# Altium schematic sheet AudioAmpSchematic.SchDoc
size A4
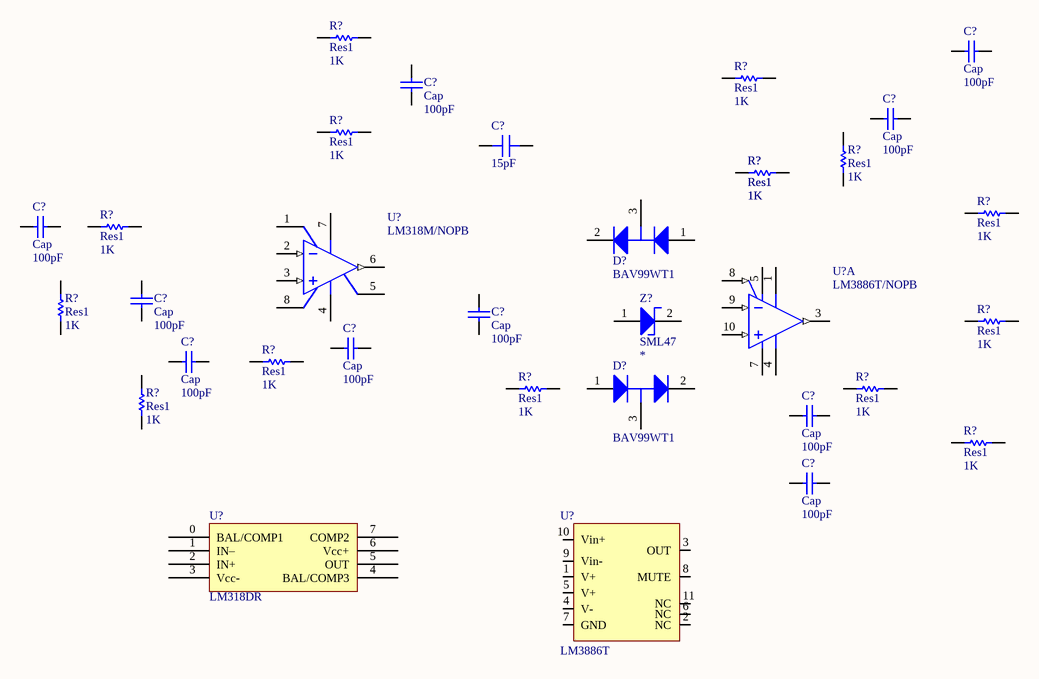
[diagram p0: AudioAmpSchematic.SchDoc]

## Parts
(Parts that share a designator on the sheet are numbered #1, #2 ... from top to bottom, then left to right.)
C?#1  Cap  value 100pF  [RAD-0.3]
C?#2  Cap  value 100pF  [RAD-0.3]
C?#3  Cap  value 100pF  [RAD-0.3]
C?#4  15pF  [CAP 0402_1005]
C?#5  Cap  value 100pF  [RAD-0.3]
C?#6  Cap  value 100pF  [RAD-0.3]
C?#7  Cap  value 100pF  [RAD-0.3]
C?#8  Cap  value 100pF  [RAD-0.3]
C?#9  Cap  value 100pF  [RAD-0.3]
C?#10  Cap  value 100pF  [RAD-0.3]
C?#11  Cap  value 100pF  [RAD-0.3]
D?#1  BAV99WT1  [ONSC-SOT-323-3-419-04_V]
D?#2  BAV99WT1  [ONSC-SOT-323-3-419-04_V]
R?#1  Res1  value 1K  [AXIAL-0.3]
R?#2  Res1  value 1K  [AXIAL-0.3]
R?#3  Res1  value 1K  [AXIAL-0.3]
R?#4  Res1  value 1K  [AXIAL-0.3]
R?#5  Res1  value 1K  [AXIAL-0.3]
R?#6  Res1  value 1K  [AXIAL-0.3]
R?#7  Res1  value 1K  [AXIAL-0.3]
R?#8  Res1  value 1K  [AXIAL-0.3]
R?#9  Res1  value 1K  [AXIAL-0.3]
R?#10  Res1  value 1K  [AXIAL-0.3]
R?#11  Res1  value 1K  [AXIAL-0.3]
R?#12  Res1  value 1K  [AXIAL-0.3]
R?#13  Res1  value 1K  [AXIAL-0.3]
R?#14  Res1  value 1K  [AXIAL-0.3]
R?#15  Res1  value 1K  [AXIAL-0.3]
U?#1  LM318M/NOPB  [M08A_N]
U?#2  LM3886T/NOPB  [TI-NDJ11]  (part A of 2)
U?#3  LM3886T  [TF11B]
U?#4  LM318DR  [SOIC127P780X200-8N]
Z?  SML47  [SML47]

## Nets
NetR?#5_1: R?#5.1 R?#6.1
NetR?#5_2: R?#5.2 R?#6.2

Not connected (* = marked no-connect by the designer): C?#1 1 2; C?#2 1 2; C?#3 1 2; C?#4 1 2; C?#5 1 2; C?#6 1 2; C?#7 1 2; C?#8 1 2; C?#9 1 2; C?#10 1 2; C?#11 1 2; D?#1 1(A) 2(K) 3(K/A); D?#2 1(A) 2(K) 3(K/A); R?#1 1 2; R?#2 1 2; R?#3 1 2; R?#4 1 2; R?#7 1 2; R?#8 1 2; R?#9 1 2; R?#10 1 2; R?#11 1 2; R?#12 1 2; R?#13 1 2; R?#14 1 2; R?#15 1 2; U?#1 1(BAL/COMP1) 2(IN-) 3(IN+) 4(V-) 5(BAL/COMP3) 6(OUT) 7(V+) 8(COMP2); U?#2 1(V+) 3(OUTPUT) 4(V-) 5(V+) 7(GND) 8(MUTE) 9(VIN-) 10(VIN+); U?#3 1(V+) 2(NC) 3(OUT) 4(V-) 5(V+) 6(NC) 7(GND) 8(MUTE) 9(Vin-) 10(Vin+) 11(NC); U?#4 0(BAL/COMP1) 1(IN–) 2(IN+) 3(Vcc-) 4(BAL/COMP3) 5(OUT) 6(Vcc+) 7(COMP2); Z? 1 2

## Library data of the parts
C?#1-C?#3 C?#5-C?#11 = Cap: Capacitor; Published: 8-Jun-2000; LatestRevisionDate: 17-Jul-2002; LatestRevisionNote: Re-released for DXP Platform.; PackageReference: RAD-0.3; Publisher: Altium Limited; PackageDescription: Radial Cap, Thru-Hole; 2 Leads; 0.3 in Pin Spacing
C?#4 = CBR04C150J5GAC: CAP CER 15PF 50V C0G/NP0 0402; Manufacturer: KEMET; Temperature Coefficient: C0G, NP0; Tolerance: ±5%; Part Number: CBR04C150J5GAC; Value: 15pF; Applications: RF, Microwave, High Frequency; Capacitance: 15pF; ComponentLink1Description: Datasheet; ComponentLink1URL: https://api.kemet.com/component-edge/download/datasheet/CBR04C150J5GAC.pdf; ComponentLink2Description: DigiKey Link; ComponentLink2URL: http://digikey.com/product-detail/en/kemet/CBR04C150J5GAC/399-6170-1-ND/2732139; Device Package: 0402 (1005 Metric); Features: High Q, Low Loss, Ultra Low ESR; LastUpdated: 9/2/2020 1:02:25 AM; Lifecycle Status: Active; Minimum Order: 1; Mounting Type: Surface Mount, MLCC; Operating Temperature: -55°C ~ 125°C; Package / Case: 0402 (1005 Metric); Packaging: TapeAndReel; PartId: 1728; Part Status: Active; Price: 0.02; Series: CBR-SMD RF C0G; Size / Dimension: 0.039" L x 0.020" W (1.00mm x 0.50mm); Supplier 1: DigiKey; Supplier Part Number 1: 399-6170-1-ND; Thickness (Max): 0.022" (0.55mm); Voltage - Rated: 50V
D?#1 D?#2 = BAV99WT1: Dual Series Switching Diodes, 3-Pin SOT-323, Tape and Reel; Manufacturer: On Semiconductor; IF Max (A): 0.215; trr Max (ns): 6; DatasheetVersion: Rev. 7; PackageVersion: Rev. N, 11/2008; PackageReference: SOT-323-3-419-04; PackageDescription: 3-Pin Small Outline Transistor, Body 2 x 1.25 mm, Pitch 0.65 mm; Supplier 1: Digi-Key; Supplier Part Number 1: BAV99WT1OSCT-ND; Configuration: Dual Series; Packing: Tape and Reel; RoHS: FALSE; Mounting Technology: Surface Mount; PartNumber: BAV99WT1; ComponentLink1Description: Manufacturer URL; ComponentLink1URL: http://www.onsemi.com/; ComponentLink2Description: Datasheet; ComponentLink2URL: http://www.onsemi.cn/pub_link/Collateral/BAV99WT1-D.PDF; ComponentLink3Description: Package Specification; ComponentLink3URL: http://www.onsemi.com/pub_link/Collateral/419-04.PDF
R?#1-R?#15 = Res1: Resistor; Published: 8-Jun-2000; LatestRevisionDate: 17-Jul-2002; LatestRevisionNote: Re-released for DXP Platform.; PackageReference: AXIAL-0.3; Publisher: Altium Limited; PackageDescription: Axial Device, Thru-Hole; 2 Leads; 0.3 in Pin Spacing
U?#1 = LM318M/NOPB: Operational Amplifier, 8-pin Narrow SOIC, Pb-Free; Manufacturer: National Semiconductor; PackageTopMarking: NSZXTT*LM*318M; PowerWise: N; CompType: Amplifiers; High-Reliability: Y; DatasheetVersion: Aug-2000; PackageVersion: revM, May-2009; PackageReference: M08A; PackageDescription: SOIC Narrow, 4.9 x 3.9 x 1.45mm, 8 Lead, 1.27mm Pitch; PartNumber: LM318M/NOPB; RoHS: Y; PinCount: 8; Code_JEDEC: MS-012-AA; Code_IPC: SOIC127P600-8; ComponentLink1Description: Manufacturer URL; ComponentLink1URL: http://www.national.com/; ComponentLink2Description: LM318 Datasheet; ComponentLink2URL: http://www.national.com/ds/LM/LM318.pdf; ComponentLink3Description: LM318 Web Page; ComponentLink3URL: http://www.national.com/pf/LM/LM318.html; ComponentLink4Description: M08A Package Page; ComponentLink4URL: http://www.national.com/packaging/folders/m08a.html
U?#2 = LM3886T/NOPB: High-Performance 68 W Audio Power Amplifier with Mute, 0 to 70 degC, 11-pin FM (NDJ11), Green (RoHS & no Sb/Br); Manufacturer: Texas Instruments; Input Type: Analog; SubFamily: Mid/High-Power Amplifier; DatasheetVersion: SNAS091C; PackageVersion: Rev. B, 05/2013; PackageReference: NDJ11; PackageDescription: 11-Pin Metal Flange Mount, Body 20.02 x 4.5, Pitch 1.7 mm; Supplier 1: Digi-Key; Supplier Part Number 1: LM3886T/NOPB-ND; Supplier 2: Farnell; Supplier Part Number 2: 1468869; Supplier 3: Newark; Supplier Part Number 3: 41K5109; Supplier 4: Mouser; Supplier Part Number 4: 926-LM3886T/NOPB; Eco-Plan: Green (RoHS & no Sb/Br); Mounting Technology: Through Hole; PartNumber: LM3886T/NOPB; ComponentLink1Description: Manufacturer URL; ComponentLink1URL: http://www.ti.com/; ComponentLink2Description: Datasheet; ComponentLink2URL: http://www.ti.com/general/docs/lit/getliterature.tsp?genericPartNumber=LM3886&fileType=pdf; ComponentLink3Description: Package Specification; ComponentLink3URL: http://www.ti.com/lit/ds/symlink/lm3886.pdf
U?#3 = LM3886T: Audio Amp Speaker 1-CH Mono 68W Class-AB 11-Pin(11+Tab) TO-220 Rail; Manufacturer: TI National Semiconductor; Voltage Gain: 115dB; Min Supply Voltage: 20V; Max Supply Voltage: 84V; Min Dual Supply Voltage: 10V; Max Dual Supply Voltage: 42V; Gain Bandwidth Product: 8MHz; Power Supply Rejection Ratio (PSRR): 120dB; Common Mode Rejection Ratio: 85dB; Max Power Dissipation: 125W; Number of Channels: 1; Input Offset Voltage (Vos): 10mV; Input Bias Current: 1uA; Quiescent Current: 85mA; Supply Type: Single,Dual; Load Impedance: 8R; Max Output Current: 11.5A; Dual Supply Voltage: 28V; Supplier 1: Farnell; Manufacturer Part Number: LM3886T; RoHS: No; Category: Amplifiers - Op Amps, Buffer, Instrumentation; Pricing 1: 1=6.53000, 10=5.38000, 25=4.98000, 50=4.72000, 100=4.45000, 250=4.23000, 500=3.38000 (EUR); Mount: Through Hole; Case/Package: TO-220; Number of Pins: 11; Weight: 0.01lb; Min Operating Temperature: -20°C; Max Operating Temperature: 85°C; Output Power: 68W; Packaging: Rail/Tube; Package Quantity: 20; Unity Gain Bandwidth Product: 8MHz; Max Output Power: 68W; Power Dissipation: 125W; Output Current: 11.5A; Series: Overture™; Length: 20.02mm; Width: 4.5mm; Height: 10.69mm; Radiation Hardening: No; REACH SVHC: No SVHC; RoHS Compliant: No; ComponentLink1URL: https://datasheet.ciiva.com/1480/21456-1480999.pdf?src-supplier=Element14; ComponentLink1Description: https://datasheet.ciiva.com/1480/21456-1480999.pdf?src-supplier=Element14; ComponentLink2URL: https://datasheet.ciiva.com/26842/lm3886t-26842547.pdf?src-supplier=IIIC; ComponentLink2Description: https://datasheet.ciiva.com/26842/lm3886t-26842547.pdf?src-supplier=IIIC; Supplier Part Number 1: 9493603
U?#4 = LM318DR: Single High-Speed Operational Amplifier 8-SOIC 0 to 70; Manufacturer: Texas Instruments; -3db Bandwidth: 15MHz; Voltage Gain: 106.02dB; Slew Rate: 70V/µs; Min Dual Supply Voltage: 5V; Max Dual Supply Voltage: 20V; Common Mode Rejection Ratio: 70dB; Number of Channels: 1; Nominal Supply Current: 10mA; Input Bias Current: 500nA; Input Offset Voltage (Vos): 10mV; Operating Supply Current: 5mA; Amplifier Type: GENERAL PURPOSE; Dual Supply Voltage: 9V; Supplier 1: Digi-Key; RoHS: Yes; Category: Amplifiers - Op Amps, Buffer, Instrumentation; Stock 1: 7674; Pricing 1: 1=1.54000, 10=1.37600, 25=1.30600, 100=1.07270, 250=1.00276, 500=0.88616, 1000=0.77000 (USD); Mount: Surface Mount; Case/Package: SOIC; Number of Pins: 8; Min Operating Temperature: 0°C; Max Operating Temperature: 70°C; Packaging: Tape and Reel; Package Quantity: 2500; Unity Gain Bandwidth Product: 15MHz; Operating Supply Voltage: 20V; Number of Circuits: 1; Gain Bandwidth Product: 15MHz; Number of Elements: 1; Bandwidth: 15MHz; Supply Current: 10mA; Technology: BIPOLAR; Series: -; Length: 4.9mm; Width: 3.91mm; Height: 1.58mm; Radiation Hardening: No; Lead Free: Lead Free; RoHS Compliant: Yes; ComponentLink1URL: https://datasheet.ciiva.com/1812/lm318-1812531.pdf?src-supplier=Digi-Key; ComponentLink1Description: https://datasheet.ciiva.com/1812/lm318-1812531.pdf?src-supplier=Digi-Key; ComponentLink2URL: https://datasheet.ciiva.com/1812/lm318-1812532.pdf?src-supplier=Digi-Key; ComponentLink2Description: https://datasheet.ciiva.com/1812/lm318-1812532.pdf?src-supplier=Digi-Key; ComponentLink3URL: https://datasheet.ciiva.com/1812/lm318-1812533.pdf?src-supplier=Digi-Key; ComponentLink3Description: https://datasheet.ciiva.com/1812/lm318-1812533.pdf?src-supplier=Digi-Key; ComponentLink4URL: https://datasheet.ciiva.com/26223/slos063b-26223324.pdf?src-supplier=Avnet+Europe; ComponentLink4Description: https://datasheet.ciiva.com/26223/slos063b-26223324.pdf?src-supplier=Avnet+Europe; Supplier Part Number 1: 296-24358-1-ND; Manufacturer Part Number: LM318DR
Z? = SML47: Zener Diode; Zener Voltage: *